# Altium schematic sheet 原理图.SchDoc
size A4
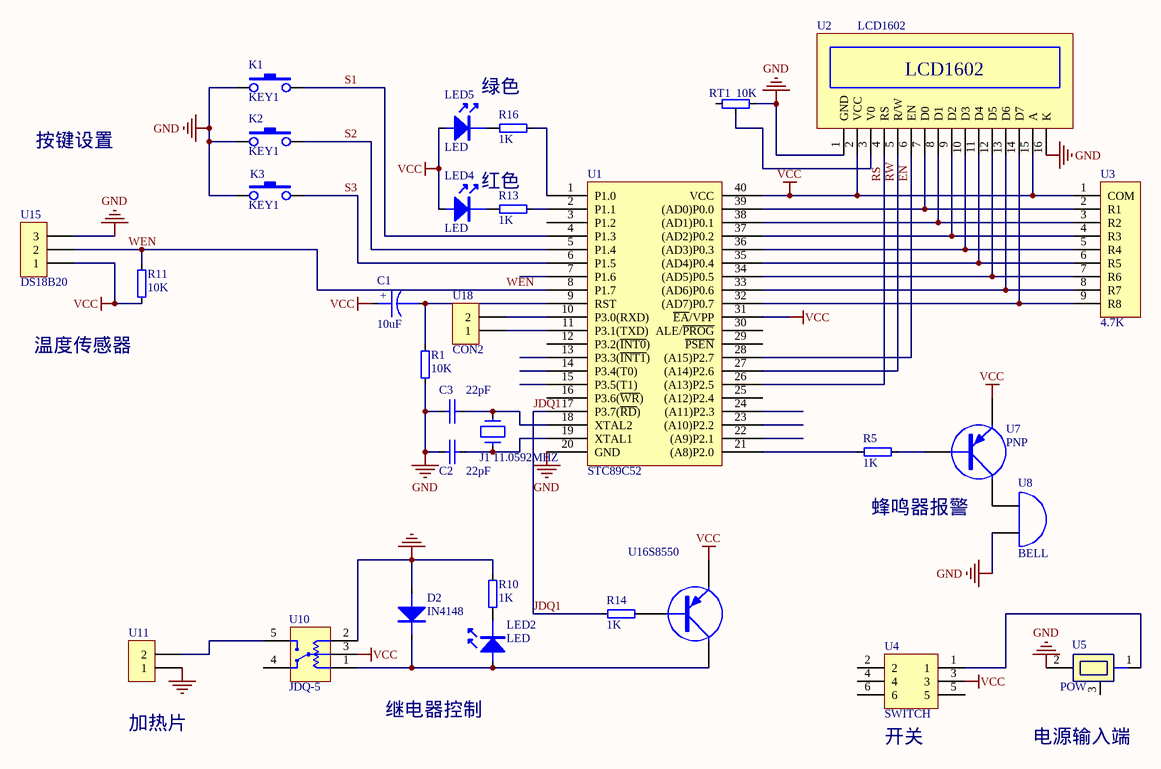
[diagram p0: 原理图.SchDoc]

## Parts
C1  10uF  [C10]
C2  22pF  [CAP]
C3  22pF  [CAP]
D2  IN4148  [IN4148]
J1  11.0592MHZ  [CRYSTAL]
K1  KEY1  [KEY1]
K2  KEY1  [KEY1]
K3  KEY1  [KEY1]
LED2  LED  [LED]
LED4  LED  [LED]
LED5  LED  [LED]
R1  10K  [R-DIP]
R5  1K  [R-DIP]
R10  1K  [R-DIP]
R11  10K  [R-DIP]
R13  1K  [R-DIP]
R14  1K  [R-DIP]
R16  1K  [R-DIP]
RT1  10K  [RT1]
U1  STC89C52  [STC]
U2  LCD1602  [LCD1602]
U3  4.7K  [SIP9]
U4  SWITCH  [KG1]
U5  POW  [DCM]
U7  PNP  [PNP]
U8  BELL  [BEEP]
U10  JDQ-5  [JDQ-5]
U11  (no value)  [SIP2]
U15  DS18B20  [SIP3]
U16S8550  (no value)  [PNP]
U18  CON2  [SIP2]

## Nets
GND: C2.1 C3.1 D2.1(A) K1.1 K2.1 K3.1 R1.2 R10.1 RT1.3 U1.20(GND) U2.1(GND) U2.16(K) U5.2 U8.2(B) U10.2 U11.1 U15.3
VCC: C1.1 LED4.1 LED5.1 R11.1 U1.31(~{EA}/VPP) U1.40(VCC) U2.2(VCC) U2.15(A) U3.1(COM) U4.3 U7.2(E) U10.3(IN) U15.1 U16S8550.2(E)
EN: U1.28((A15)P2.7) U2.6(EN)
JDQ1: R14.1 U1.17(P3.7(~{RD}))
RS: U1.26((A13)P2.5) U2.4(RS)
RW: U1.27((A14)P2.6) U2.5(R/W)
S1: K1.2 U1.4(P1.3)
S2: K2.2 U1.5(P1.4)
S3: K3.2 U1.6(P1.5)
WEN: R11.2 U1.8(P1.7) U15.2
NetC1_2: C1.2 R1.1 U1.9(RST)
NetC2_2: C2.2 J1.2 U1.18(XTAL2)
NetC3_2: C3.2 J1.1 U1.19(XTAL1)
NetD2_2: D2.2(K) LED2.1 U10.1 U16S8550.3(C)
NetLED2_2: LED2.2 R10.2
NetLED4_2: LED4.2 R13.2
NetLED5_2: LED5.2 R16.2
NetR5_1: R5.1 U1.21((A8)P2.0)
NetR5_2: R5.2 U7.1(B)
NetR13_1: R13.1 U1.2(P1.1)
NetR14_2: R14.2 U16S8550.1(B)
NetR16_1: R16.1 U1.1(P1.0)
NetRT1_2: RT1.2 U2.3(V0)
NetU1_10: U1.10(P3.0(RXD)) U18.2
NetU1_11: U1.11(P3.1(TXD)) U18.1
NetU1_32: U1.32((AD7)P0.7) U2.14(D7) U3.9(R8)
NetU1_33: U1.33((AD6)P0.6) U2.13(D6) U3.8(R7)
NetU1_34: U1.34((AD5)P0.5) U2.12(D5) U3.7(R6)
NetU1_35: U1.35((AD4)P0.4) U2.11(D4) U3.6(R5)
NetU1_36: U1.36((AD3)P0.3) U2.10(D3) U3.5(R4)
NetU1_37: U1.37((AD2)P0.2) U2.9(D2) U3.4(R3)
NetU1_38: U1.38((AD1)P0.1) U2.8(D1) U3.3(R2)
NetU1_39: U1.39((AD0)P0.0) U2.7(D0) U3.2(R1)
NetU4_1: U4.1 U5.1
NetU7_3: U7.3(C) U8.1(A)
NetU10_5: U10.5(IN) U11.2

Not connected (* = marked no-connect by the designer): RT1 1; U1 3(P1.2) 7(P1.6) 12(P3.2(~{INT0})) 13(P3.3(~{INT1})) 14(P3.4(T0)) 15(P3.5(T1)) 16(P3.6(~{WR})) 22((A9)P2.1) 23((A10)P2.2) 24((A11)P2.3) 25((A12)P2.4) 29(~{PSEN}) 30(ALE/~{PROG}); U4 2 4 5 6; U5 3; U10 4(IN)

## Notes on the sheet
- 绿色
- 按键设置
- 红色
- 温度传感器
- 蜂鸣器报警
- (near U11) 加热片
- 继电器控制
- (near U4) 开关
- (near U5) 电源输入端
- (in symbol 10uF) +

## Library data of the parts
C2 C3 = 0.1uF
D2 = DIODE
J1 = CRYSTAL
RT1 = RT
U1 = STC51
U3 = PAIZU
U11 = CON2
U15 = CON3
U16S8550 = PNP